# EAGLE design Adafruit min8x8 backpack (EAGLE 6.2)
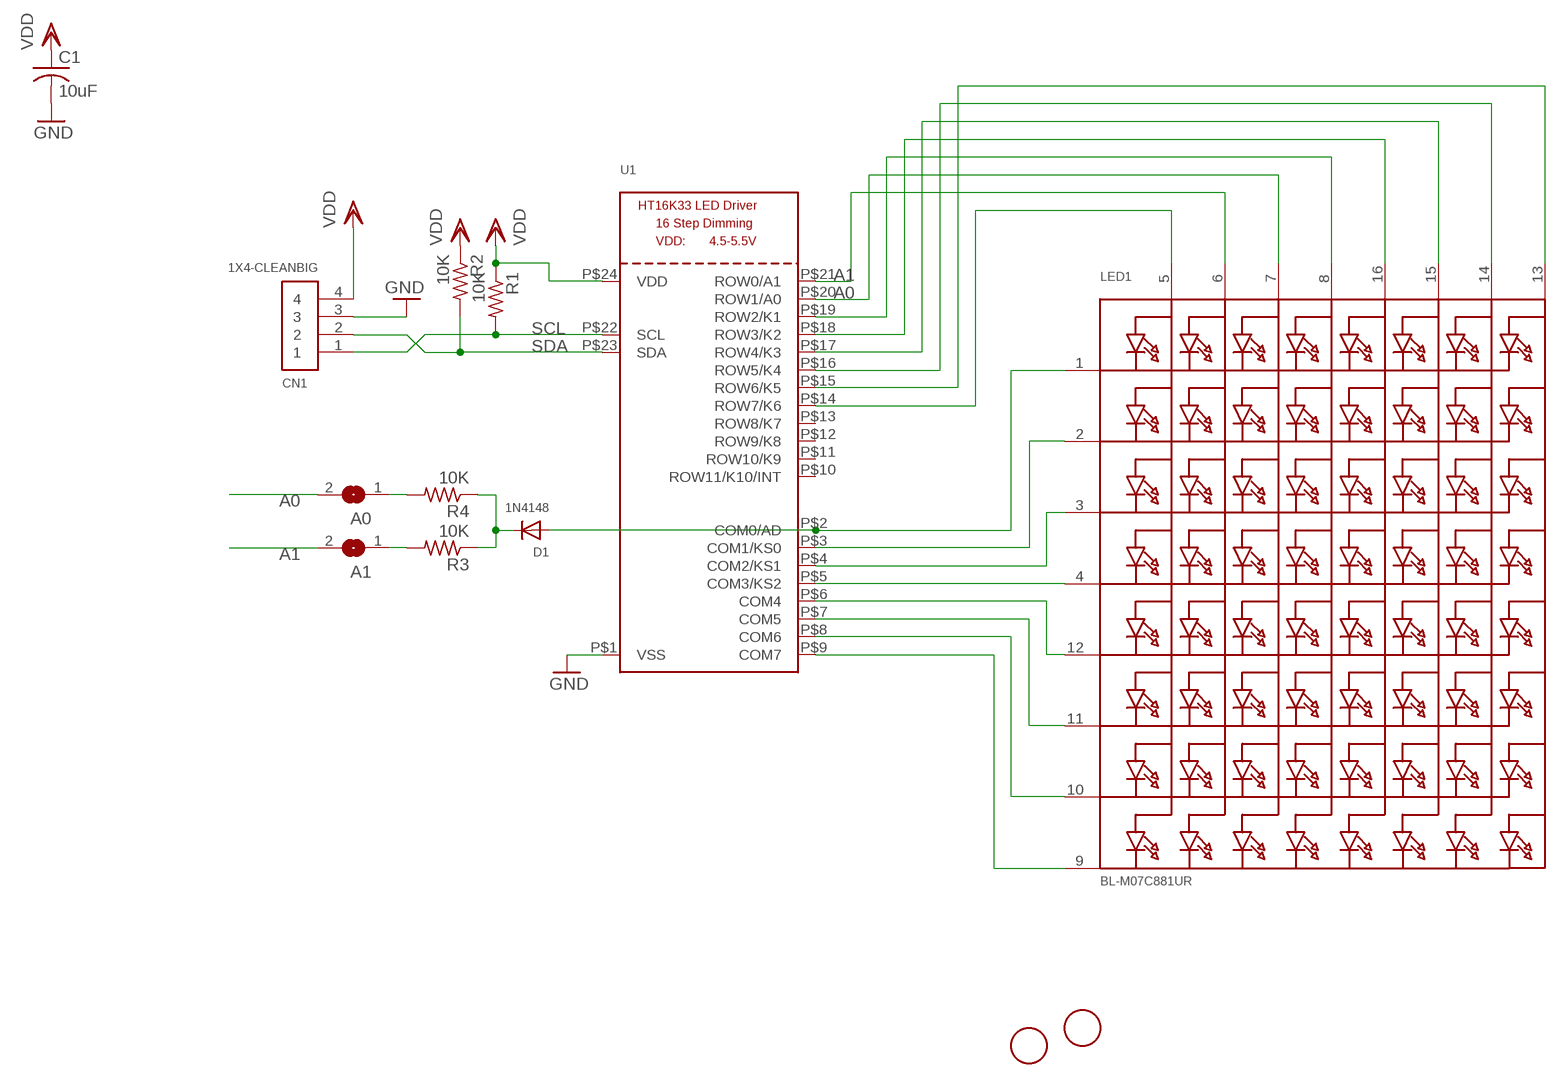
[diagram p0: schematic, sheet 1]

## Parts
A0  SOLDERJUMPERREFLOW_NOPASTE  [SOLDERJUMPER_REFLOW_NOPASTE]
A1  SOLDERJUMPERREFLOW_NOPASTE  [SOLDERJUMPER_REFLOW_NOPASTE]
C1  10uF  C-USC0805  [C0805]
CN1  1X4-CLEANBIG  [1X04-CLEANBIG]
D1  1N4148  DIODESOD-323F  [SOD-323F]
LED1  BL-M07C881UR  DISP_SEGMENT_8X8_ROWCATHODE  [SEGMENT_BL-M07C881UR]
R1  10K  R-US_R0805  [R0805]
R2  10K  R-US_R0805  [R0805]
R3  10K  R-US_R0805  [R0805]
R4  10K  R-US_R0805  [R0805]
U1  HT16K33_SOP24  [SOP24_300MIL]
U$1  FIDUCIAL  [FIDUCIAL_1MM]
U$2  FIDUCIAL  [FIDUCIAL_1MM]

## Nets
A0: A0.2 LED1.7(A3) U1.P$20(ROW1/A0)
A1: A1.2 LED1.6(A2) U1.P$21(ROW0/A1)
GND: C1.2 CN1.3 U1.P$1(VSS)
N$1: LED1.9(K8) U1.P$9(COM7)
N$2: LED1.10(K7) U1.P$8(COM6)
N$3: LED1.11(K6) U1.P$7(COM5)
N$4: LED1.12(K5) U1.P$6(COM4)
N$5: LED1.4(K4) U1.P$5(COM3/KS2)
N$6: LED1.3(K3) U1.P$4(COM2/KS1)
N$7: LED1.2(K2) U1.P$3(COM1/KS0)
N$8: D1.A LED1.1(K1) U1.P$2(COM0/AD)
N$11: LED1.8(A4) U1.P$19(ROW2/K1)
N$12: LED1.16(A5) U1.P$18(ROW3/K2)
N$13: LED1.15(A6) U1.P$17(ROW4/K3)
N$14: D1.C R3.1 R4.1
N$16: LED1.5(A1) U1.P$14(ROW7/K6)
N$19: A1.1 R3.2
N$20: A0.1 R4.2
SCL: CN1.1 R1.2 U1.P$22(SCL)
SDA: CN1.2 R2.2 U1.P$23(SDA)
SEG_F: LED1.14(A7) U1.P$16(ROW5/K4)
SEG_G: LED1.13(A8) U1.P$15(ROW6/K5)
VDD: C1.1 CN1.4 R1.1 R2.1 U1.P$24(VDD)
Unconnected: U1.P$10(ROW11/K10/INT) U1.P$11(ROW10/K9) U1.P$12(ROW9/K8) U1.P$13(ROW8/K7)

## Library data of the parts
A0 A1 = microbuilder:SOLDERJUMPER: SMD Solder JUMPER Solder the two pads together to create a connection, or remove the solder to break it. REFLOW - Use this footprint for solder paste and reflow ovens. WAVE - Use this footprint for hand-soldering (larger pads). CLOSED - Has a trace between the two pads to ensure it is closed by default. The trace needs to be cut to disable the jumper, and can be closed again by creating a solder bridge between the two pads.
C1 = rcl:C-US: CAPACITOR, American symbol
CN1 = adafruit:1X4: 4-pin connector
D1 = adafruit:DIODE: Diode SMADIODE - SMA Surface Mount Package 20V 1A Schottky Diode Digikey: 641-1014-6-ND DO-1N4148 - Through Hole Small Current Diode SOD-123 20V 1 A (.5mV Vf) Schottky Diode - Digikey: MBRX120TPMSCT-ND SOD-323 10V 570mA (.38mV Vf, 3ns) Schottky Diode - Digikey: ZLLS410CT-ND SOD-523 30V 30mA Schottky Diode (RB751S-40TE61) - Digikey: RB751S-40TE61CT-ND SOT23-R/W - SOT23 Package (R = Solder Paste/Reflow Ovens, W = Hand-Soldering) BAT54Film 40V 300mA - Digikey: 497-7162-1-ND
LED1 = microbuilder:DISP_SEGMENT_8X8_ROWCATHODE: 8x8 LED Segment Displays: Row = Cathode 0.7" Red 8X8 Matrix, 1.9mm Round LEDs - BL-M07C881UR 1.2" Red 8x8 Matrix, 3.0mm Round LEDs - BL-M12A881UR 1.2" Red 8x8 Matrix, 3.0mm Square LEDs - BL-M12A883
R1-R4 = adafruit:R-US_: RESISTOR, American symbol
U1 = microbuilder:HT16K33_SOP24
U$1 U$2 = adafruit:FIDUCIAL: For use by pick and place machines to calibrate the vision/machine, 1mm By microbuilder.eu

## Board
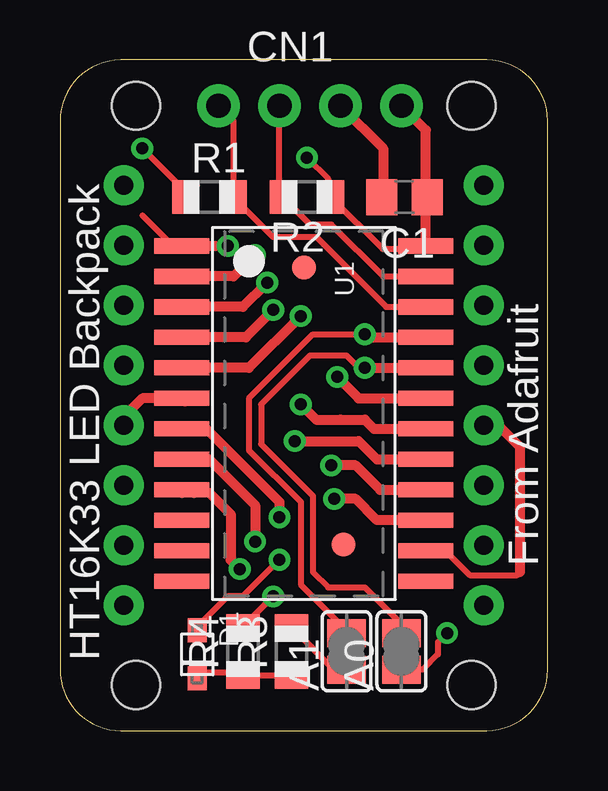
[diagram p1: board, top side]
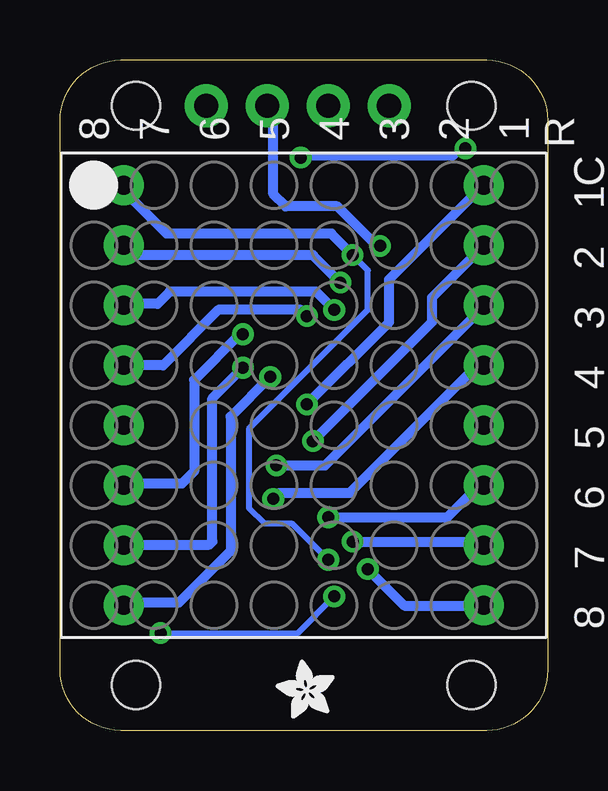
[diagram p2: board, bottom side, seen from below]

Size 20.32 x 27.94 mm. Coordinates in mm from the lower left corner, seen from the top.
Outline: 17.78,0 arc90 20.32,2.54 20.32,25.4 arc90 17.78,27.94 2.54,27.94 arc90 0,25.4 0,2.54 arc90 2.54,0 17.78,0
Copper layers (1*16): Top 0.035mm / dielectric 1.5mm / Bottom 0.035mm
Design rules: minimum track width 10mil, minimum drill 19mil, track to track 10mil, track to pad 10mil, pad to pad 10mil, via to via 10mil, smd to smd 8mil, copper to edge 10mil, drill to drill 8mil, minimum pad ring 10mil, minimum via ring 8mil, stop-mask expansion 4mil, vias tented up to drill 20mil, thermal gap 10mil
Holes 2 mm at 3.17,1.91 17.14,1.91 3.17,26.04 17.14,26.04

### Footprints (pad centres in the part's own frame; a part is rotated, then mirrored left to right if it is on the bottom)
SOLDERJUMPER_REFLOW_NOPASTE = smd 1.168 x 1.6: 1 -0.762,0; 2 0.762,0
C0805 = smd 1.3 x 1.5: 1 -0.95,0; 2 0.95,0
1X04-CLEANBIG = drill 1.016 pad 1.778: 1 -3.81,0; 2 -1.27,0; 3 1.27,0; 4 3.81,0
SOD-323F = smd 1 x 0.8: A -1,0; C 1,0
SEGMENT_BL-M07C881UR = drill 0.8 pad 1.676: 1 -8.75,-7.5; 2 -6.25,-7.5; 3 -3.75,-7.5; 4 -1.25,-7.5; 5 1.25,-7.5; 6 3.75,-7.5; 7 6.25,-7.5; 8 8.75,-7.5; 9 8.75,7.5; 10 6.25,7.5; 11 3.75,7.5; 12 1.25,7.5; 13 -1.25,7.5; 14 -3.75,7.5; 15 -6.25,7.5; 16 -8.75,7.5
R0805 = smd 1.1 x 1.4: 1 -1,0; 2 1,0
SOP24_300MIL = smd 0.635 x 2.286: P$1 -6.985,-5.08; P$2 -5.715,-5.08; P$3 -4.445,-5.08; P$4 -3.175,-5.08; P$5 -1.905,-5.08; P$6 -0.635,-5.08; P$7 0.635,-5.08; P$8 1.905,-5.08; P$9 3.175,-5.08; P$10 4.445,-5.08; P$11 5.715,-5.08; P$12 6.985,-5.08; P$13 6.985,5.08; P$14 5.715,5.08; P$15 4.445,5.08; P$16 3.175,5.08; P$17 1.905,5.08; P$18 0.635,5.08; P$19 -0.635,5.08; P$20 -1.905,5.08; P$21 -3.175,5.08; P$22 -4.445,5.08; P$23 -5.715,5.08; P$24 -6.985,5.08
FIDUCIAL_1MM = smd 1 x 1: 1 0,0

### Placement (x,y rotation side)
A0  14.22,3.3 90 top
A1  11.94,3.3 90 top
C1  14.35,22.23 180 top
CN1  10.41,26.04 0 top
D1  5.71,3.18 270 top
LED1  10.16,13.97 270 bottom
R1  6.22,22.23 0 top
R2  10.29,22.23 180 top
R3  9.65,3.3 90 top
R4  7.62,3.3 90 top
U1  10.16,13.21 270 top
U$1  11.81,7.75 0 top
U$2  10.16,19.3 0 top
U$4  [ADAFRUIT_2.5MM]  8.89,0.51 90 bottom

### Tracks (layer width: path | path; a pad name or v marks a point on that pad's centre or on a via)
A0  (via drill 0.5)
  Top 0.254: 12.95,15.11 12.45,15.11 11.94,15.62 10.41,15.62 8.38,13.59 8.38,11.94 10.54,9.78 10.54,6.6 11.18,5.97 12.7,5.97 14.22,4.45 A0.2
  Top 0.406: v12.7,15.11 12.95,15.11 U1.P$20
  Bottom 0.406: v12.7,15.11 13.97,13.84 13.97,7.87 14.1,7.75 17.65,7.75 LED1.7
A1  (via drill 0.5)
  Top 0.254: v12.7,16.51 10.54,16.51 7.87,13.84 7.87,11.68 10.03,9.53 10.03,6.08 11.81,4.3 11.81,4.06 A1.2
  Top 0.406: U1.P$21 12.83,16.38 v12.7,16.51
  Bottom 0.406: v12.7,16.51 12.83,16.51 14.73,14.61 14.73,10.8 15.24,10.29 17.65,10.29 LED1.6
GND  (via drill 0.5)
  Top 0.254: 3.43,21.46 4.7,20.19 5.21,20.19
  Top 0.406: C1.2 13.46,22.23 13.46,24.26 CN1.3 | U1.P$1 5.21,20.19 v6.99,20.19
  Bottom 0.406: v6.99,20.19 7.11,20.19 8.76,21.84 10.92,21.84 11.43,22.35 11.43,25.78 CN1.3
N$1  (via drill 0.5)
  Top 0.406: U1.P$9 4.95,10.03 5.08,9.91 5.59,9.91 6.22,9.91 7.11,9.02 7.11,7.11 v7.49,6.73
  Bottom 0.406: LED1.9 2.67,5.21 5.97,5.21 v7.49,6.73
N$2  (via drill 0.5)
  Top 0.406: U1.P$8 6.22,11.3 8.13,9.4 v8.13,7.87
  Bottom 0.406: LED1.10 2.77,7.72 2.92,7.87 v8.13,7.87
N$3  (via drill 0.5)
  Top 0.406: U1.P$7 6.1,12.57 9.14,9.53 v9.14,8.89
  Bottom 0.406: LED1.11 2.86,10.22 4.19,8.89 v9.14,8.89
N$4
  Top 0.406: LED1.12 2.66,13.07 3.43,13.84 U1.P$6 5.21,13.72
N$5  (via drill 0.5)
  Top 0.406: U1.P$5 7.87,15.11 v10.03,17.27
  Bottom 0.406: v10.03,17.27 10.29,17.53 13.72,17.53 16.02,15.22 LED1.4
N$6  (via drill 0.5)
  Top 0.406: U1.P$4 7.75,16.38 v8.89,17.53
  Bottom 0.406: v8.89,17.53 9.65,18.29 15.75,18.29 16.26,17.78 17.65,17.78 LED1.3 17.59,17.72
N$7  (via drill 0.5)
  Top 0.406: U1.P$3 7.62,17.65 v8.64,18.67
  Bottom 0.406: LED1.2 17.65,20.45 | LED1.2 | v8.64,18.67 9.78,19.81 17.27,19.81 17.65,20.19 LED1.2
N$8  (via drill 0.5)
  Top 0.254: D1.A 5.83,4.18 5.83,4.43 5.84,4.45 6.99,5.59 7.62,5.59 v9.14,7.11
  Top 0.406: U1.P$2 7.24,18.92 v8.13,19.81
  Bottom 0.254: v9.14,7.11 10.67,8.64 11.81,8.64 12.45,9.27 12.45,12.57 7.49,17.53 7.49,19.18 v8.13,19.81
  Bottom 0.406: v8.13,19.81 9.02,20.7 15.88,20.7 17.65,22.48 LED1.1 | LED1.1 17.65,22.73 | LED1.1
N$11  (via drill 0.5)
  Top 0.406: U1.P$19 12.45,13.84 v11.56,14.73
  Bottom 0.406: v11.56,14.73 13.21,13.08 13.21,7.49 15.37,5.33 17.65,5.33 LED1.8
N$12  (via drill 0.5)
  Top 0.406: U1.P$18 13.08,12.57 12.7,12.95 10.67,12.95 | v10.03,13.59 10.67,12.95 | 10.67,12.95 11.68,12.95
  Bottom 0.406: v10.03,13.59 6.6,17.02 6.6,18.8 2.67,22.73 LED1.16
N$13  (via drill 0.5)
  Top 0.406: U1.P$17 13.21,11.3 12.45,12.07 v9.78,12.07
  Bottom 0.406: LED1.15 2.66,20.2 4.83,18.03 4.83,17.02 v9.78,12.07
N$14
  Top 0.254: D1.C 5.95,2.41 7.51,2.41 R4.1 7.64,2.29 9.64,2.29 R3.1
N$16
  Top 0.254: 16.05,7.49 17.07,6.48 19.05,6.48 19.18,6.6
  Top 0.406: 16.13,7.49 16.05,7.49 U1.P$14 15.11,7.49 | 19.18,6.6 19.18,11.81 18.29,12.7 17.68,12.7 LED1.5
N$19
  Top 0.254: A1.1 12.06,2.41 11.54,2.41 R3.2
N$20  (via drill 0.5)
  Top 0.254: A0.1 15.11,2.54 15.75,3.18 15.75,3.68 v16.13,4.06 | R4.2 7.62,4.32 v8.89,5.59
  Bottom 0.254: v16.13,4.06 10.41,4.06 v8.89,5.59
SCL
  Top 0.254: 15.37,17.53 15.49,17.53 | U1.P$22 15.37,17.53 | 15.37,17.53 14.61,17.53 | CN1.1 7.24,25.4 7.24,22.24 R1.2 8.87,20.57 10.67,20.57 13.59,17.65 U1.P$22 | U1.P$22 15.37,17.65
SDA
  Top 0.254: U1.P$23 13.46,18.92 11.3,21.08 10.43,21.08 R2.2 9.14,22.37 CN1.2
SEG_F  (via drill 0.5)
  Top 0.406: U1.P$16 13.34,10.03 12.32,11.05 v11.3,11.05
  Bottom 0.406: LED1.14 2.6,17.72 9.27,11.05 v11.3,11.05
SEG_G  (via drill 0.5)
  Top 0.406: U1.P$15 13.21,8.76 12.32,9.65 v11.43,9.65
  Bottom 0.406: LED1.13 2.9,15.22 2.92,15.24 8.26,9.91 11.18,9.91 v11.43,9.65
VDD  (via drill 0.5)
  Top 0.254: U1.P$24 15.37,20.07 13.45,20.07 R2.1 11.18,22.23 11.18,22.99 v10.29,23.88 | 5.21,22.24 R1.1 5.71,22.72 4.97,22.72 v3.43,24.26
  Top 0.406: 15.24,22.23 C1.1 | CN1.4 15.24,25.02 15.24,22.23 | U1.P$24 15.24,22.23
  Bottom 0.254: v3.43,24.26 3.56,24.26 3.94,23.88 v10.29,23.88

### Text on the board
tPlace: From Adafruit | HT16K33 LED Backpack
tDocu: SCL | SDA | GND | VCC | A1 | A0
bDocu: C | D | - | +